# Altium schematic sheet General.SchDoc
size A3
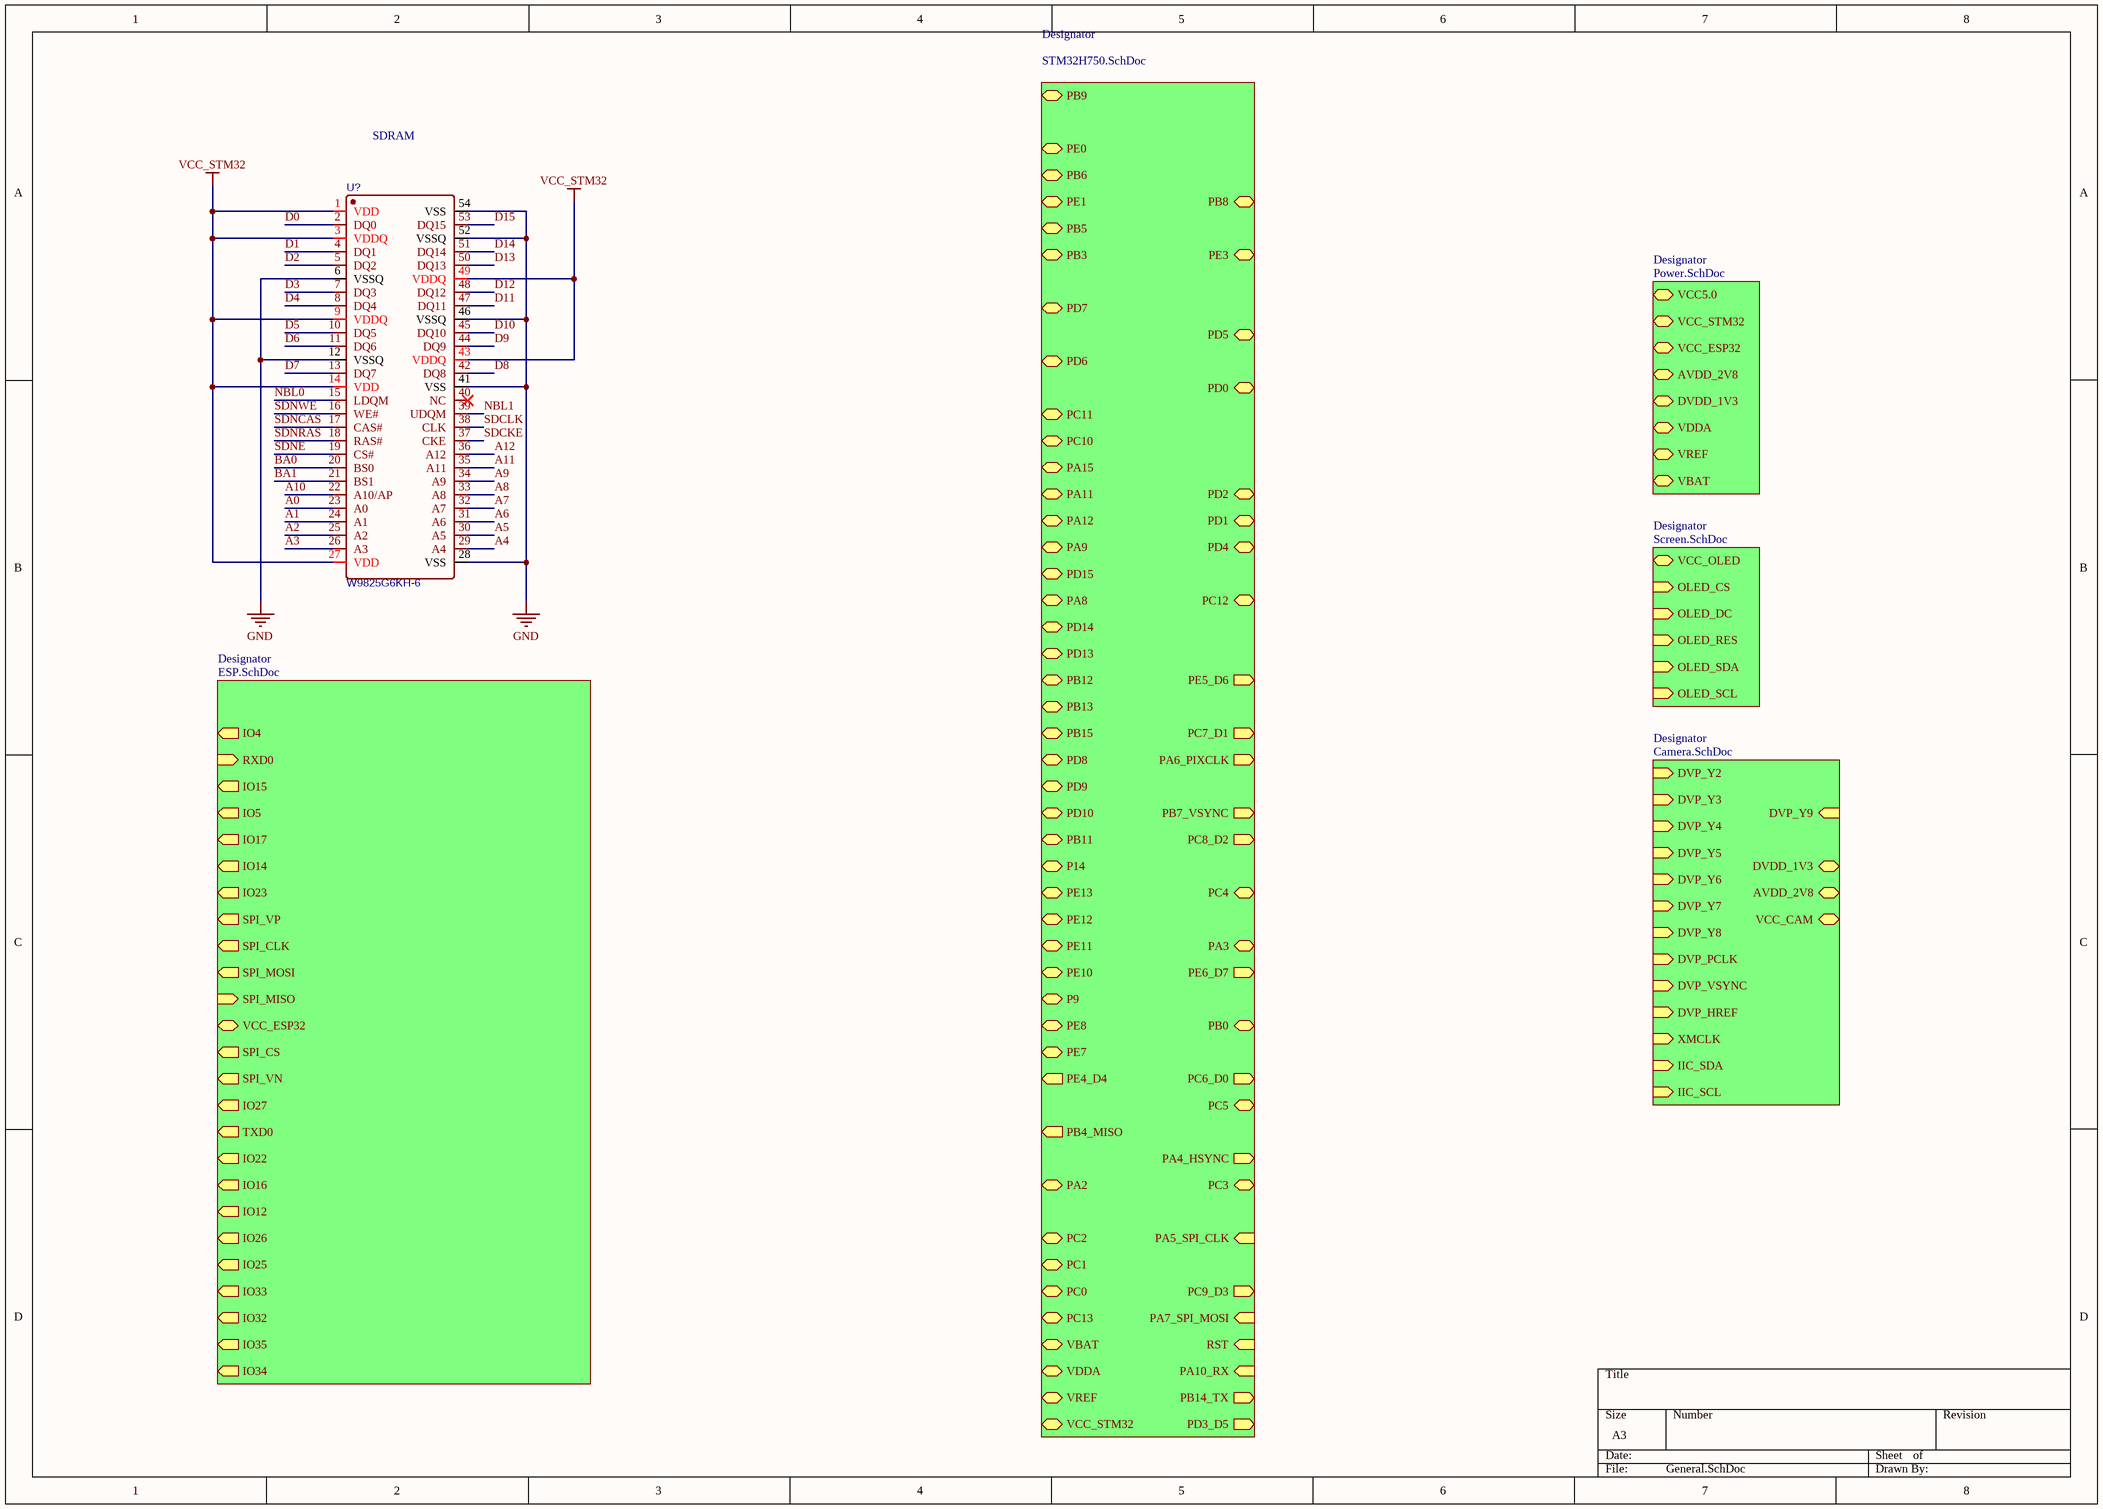
[diagram p0: General.SchDoc]

## Parts
U?  W9825G6KH-6  [W9825G6KH]

## Sub-sheets
Designator = Camera.SchDoc: DVP_Y2 (in), VCC_CAM (bidir), DVP_Y6 (in), DVP_Y4 (in), DVP_Y3 (in), DVP_Y8 (in), DVP_Y9 (in), AVDD_2V8 (bidir), DVDD_1V3 (bidir), DVP_Y5 (in), DVP_Y7 (in), DVP_PCLK (in), XMCLK (in), DVP_VSYNC (in), DVP_HREF (in), IIC_SDA (in), IIC_SCL (in)
Designator = ESP.SchDoc: IO4 (out), RXD0 (in), IO15 (out), IO5 (out), IO17 (out), IO14 (out), IO23 (out), SPI_VP (out), SPI_CLK (out), SPI_MOSI (out), SPI_MISO (in), VCC_ESP32 (bidir), SPI_CS (out), SPI_VN (out), IO27 (out), TXD0 (out), IO22 (out), IO16 (out), IO12 (out), IO26 (out), IO25 (out), IO33 (out), IO32 (out), IO35 (out), IO34 (out)
Designator = Screen.SchDoc: VCC_OLED (bidir), OLED_CS (in), OLED_DC (in), OLED_RES (in), OLED_SDA (in), OLED_SCL (in)
Designator = Power.SchDoc: VCC5.0 (bidir), VBAT (bidir), DVDD_1V3 (bidir), VREF (bidir), AVDD_2V8 (bidir), VDDA (bidir), VCC_ESP32 (bidir), VCC_STM32 (bidir)
Designator = STM32H750.SchDoc: PE3 (bidir), PB8 (bidir), PB9 (bidir), PE0 (bidir), PE1 (bidir), PB6 (bidir), PB5 (bidir), PB3 (bidir), PD7 (bidir), PD6 (bidir), PD5 (bidir), PD4 (bidir), PD2 (bidir), PD1 (bidir), PD0 (bidir), PC12 (bidir), PC11 (bidir), PC10 (bidir), PA15 (bidir), PA11 (bidir), PA12 (bidir), PA9 (bidir), PD15 (bidir), PA8 (bidir), PD14 (bidir), PD13 (bidir), PB12 (bidir), PB13 (bidir), PB15 (bidir), PD8 (bidir), PD9 (bidir), PD10 (bidir), PB11 (bidir), P14 (bidir), PE13 (bidir), PE12 (bidir), PE11 (bidir), PE10 (bidir), P9 (bidir), PE8 (bidir), PE7 (bidir), PB0 (bidir), PC5 (bidir), PC4 (bidir), PA3 (bidir), PA2 (bidir), PC3 (bidir), PC2 (bidir), PC1 (bidir), PC0 (bidir), PC13 (bidir), VBAT (bidir), VDDA (bidir), VREF (bidir), VCC_STM32 (bidir), PB4_MISO (out), PD3_D5 (out), PE4_D4 (out), PC6_D0 (out), PE6_D7 (out), PC9_D3 (out), PC8_D2 (out), PB7_VSYNC (out), PA6_PIXCLK (out), PC7_D1 (out), PE5_D6 (out), PA4_HSYNC (out), PA7_SPI_MOSI (in), PA5_SPI_CLK (in), RST (in), PA10_RX (in), PB14_TX (out)

## Nets
GND: U?.6(VSSQ) U?.12(VSSQ) U?.28(VSS) U?.41(VSS) U?.46(VSSQ) U?.52(VSSQ) U?.54(VSS)
VCC_STM32: U?.1(VDD) U?.3(VDDQ) U?.9(VDDQ) U?.14(VDD) U?.27(VDD) U?.43(VDDQ) U?.49(VDDQ)
A0: U?.23(A0)
A1: U?.24(A1)
A2: U?.25(A2)
A3: U?.26(A3)
A4: U?.29(A4)
A5: U?.30(A5)
A6: U?.31(A6)
A7: U?.32(A7)
A8: U?.33(A8)
A9: U?.34(A9)
A10: U?.22(A10/AP)
A11: U?.35(A11)
A12: U?.36(A12)
BA0: U?.20(BS0)
BA1: U?.21(BS1)
D0: U?.2(DQ0)
D1: U?.4(DQ1)
D2: U?.5(DQ2)
D3: U?.7(DQ3)
D4: U?.8(DQ4)
D5: U?.10(DQ5)
D6: U?.11(DQ6)
D7: U?.13(DQ7)
D8: U?.42(DQ8)
D9: U?.44(DQ9)
D10: U?.45(DQ10)
D11: U?.47(DQ11)
D12: U?.48(DQ12)
D13: U?.50(DQ13)
D14: U?.51(DQ14)
D15: U?.53(DQ15)
NBL0: U?.15(LDQM)
NBL1: U?.39(UDQM)
SDCKE: U?.37(CKE)
SDCLK: U?.38(CLK)
SDNCAS: U?.17(CAS#)
SDNE: U?.19(CS#)
SDNRAS: U?.18(RAS#)
SDNWE: U?.16(WE#)

Not connected (* = marked no-connect by the designer): U? 40(NC)*

## Notes on the sheet
- SDRAM

## Library data of the parts
U? = W9825G6KH-6: BOM_Manufacturer: WINBOND; BOM_Supplier: LCSC; BOM_Manufacturer Part: W9825G6KH-6; BOM_Supplier Part: C62246; BOM_JLCPCB Part Class: Extended Part; spicePre: U; spiceSymbolName: W9825G6KH-6